# Altium schematic sheet DMX.SchDoc: DMX / RS485
size B; SheetNumber: 4; SheetTotal: 7; SPICEModelCacheBNOSHSNT: <root> / <DocumentId>BNOSHSNT</DocumentId> / <CacheFrame Number="0"> / <Model Name="di_2n7002k" Kind="MDL"> / <Text>*SRC=2N7002K;DI_2N7002K;MOSFETs N;Enh;60.0V 0.300A 2.00ohms  Diodes Inc. MOSFET / .MODEL DI_2N7002K  NMOS( LEVEL=1 VTO=2.50 KP=32.0m  GAMMA=3.10 / + PHI=.75  LAMBDA=104u RD=0.280 RS=0.280 / + IS=150f  PB=0.800 MJ=0.460 CBD=98.8p / + CBS=119p  CGSO=60.0n CGDO=50.0n CGBO=390n  )</Text> / </Model> / </CacheFrame> / </root>
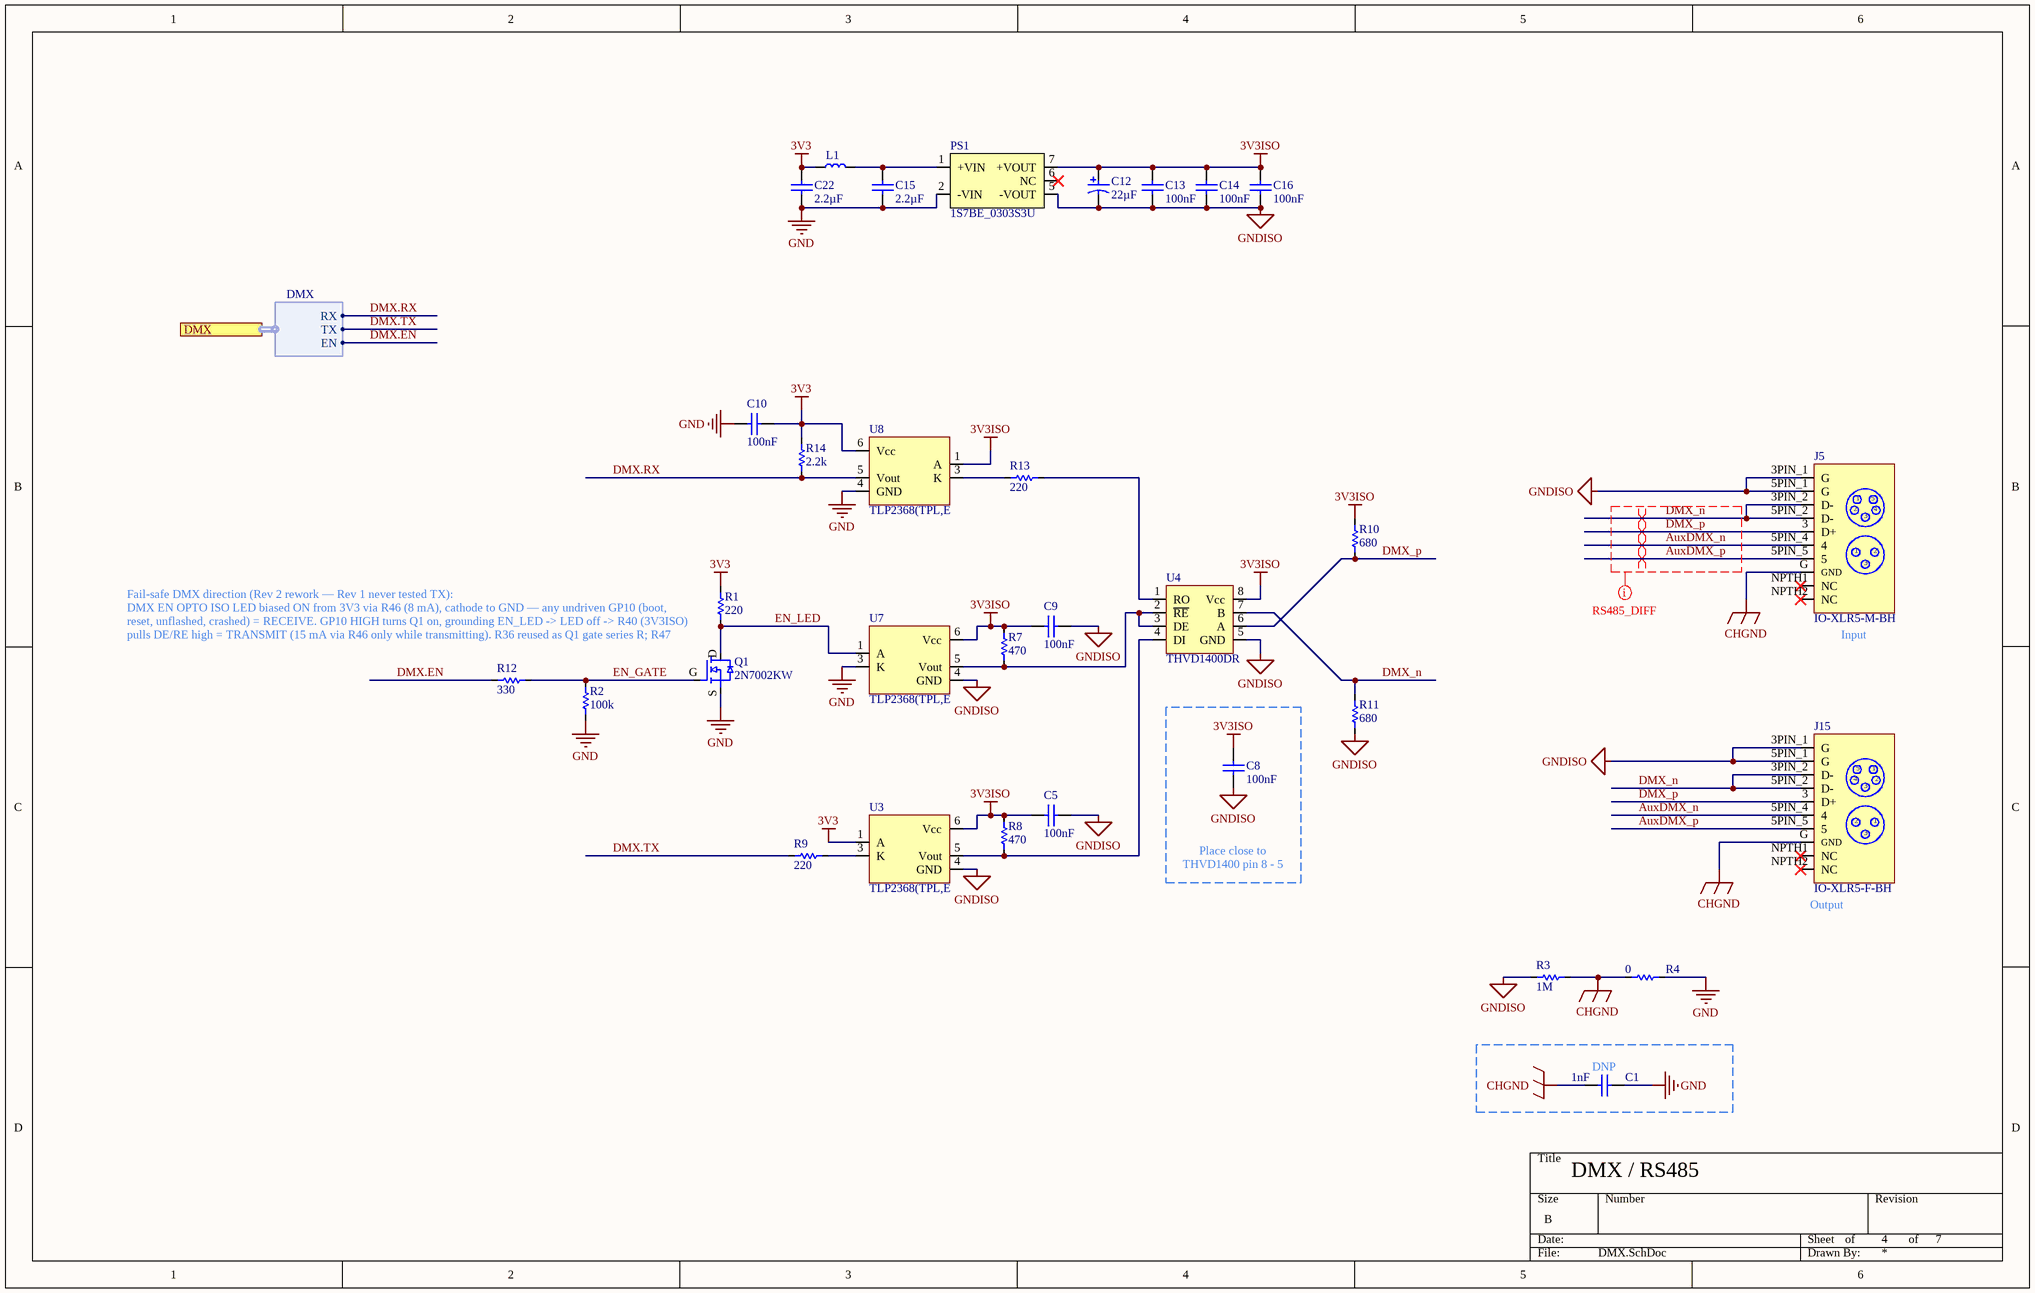
[diagram p0: DMX.SchDoc]

## Parts
C1  value 1nF  [CAPC1608X10N_0603_MED]  (hidden comment: C0603C102K5RACTU)
C5  value 100nF  [CAPC1608X10N_0603_MED]  (hidden comment: CC0603KRX7R0BB104)
C8  value 100nF  [CAPC1608X10N_0603_MED]  (hidden comment: CC0603KRX7R0BB104)
C9  value 100nF  [CAPC1608X10N_0603_MED]  (hidden comment: CC0603KRX7R0BB104)
C10  value 100nF  [CAPC1608X10N_0603_MED]  (hidden comment: CC0603KRX7R0BB104)
C12  value 22µF  [CAPCP3528X21N_1210_1411_MED]  (hidden comment: TPSB226K010R0500)
C13  value 100nF  [CAPC1608X10N_0603_MED]  (hidden comment: CC0603KRX7R0BB104)
C14  value 100nF  [CAPC1608X10N_0603_MED]  (hidden comment: CC0603KRX7R0BB104)
C15  value 2.2µF  [CAPC2012X14N_0805_MED]  (hidden comment: CGA4J3X7R1H225K125AE)
C16  value 100nF  [CAPC1608X10N_0603_MED]  (hidden comment: CC0603KRX7R0BB104)
C22  value 2.2µF  [CAPC2012X14N_0805_MED]  (hidden comment: CGA4J3X7R1H225K125AE)
J5  IO-XLR5-M-BH  [IO-XLR5-M-BH-Footprint-1]
J15  IO-XLR5-F-BH  [IO-XLR5-F-BH-Footprint-1]
L1  SRR6038-180Y  [IND_SRR6038-180Y]  (value not drawn)
PS1  1S7BE_0303S3U  [CONV_1S7BE_0303S3U]
Q1  2N7002KW  [ONSEMI_SOT65P210X110-3N]
R1  value 220  [RESC1608X06N_0603_MED]  (hidden comment: RC0603FR-07220RL)
R2  value 100k  [RESC1608X06N_0603_MED]  (hidden comment: RC0603DR-07100KL)
R3  value 1M  [RESC1608X06N_0603_MED]  (hidden comment: RC0603FR-071ML)
R4  value 0  [RESC1608X06N_0603_MED]  (hidden comment: RC0603FR-070RL)
R7  value 470  [RESC1608X06N_0603_MED]  (hidden comment: RC0603FR-07470RL)
R8  value 470  [RESC1608X06N_0603_MED]  (hidden comment: RC0603FR-07470RL)
R9  value 220  [RESC1608X06N_0603_MED]  (hidden comment: RC0603FR-07220RL)
R10  value 680  [RESC1608X06N_0603_MED]  (hidden comment: RC0603FR-07680RL)
R11  value 680  [RESC1608X06N_0603_MED]  (hidden comment: RC0603FR-07680RL)
R12  value 330  [RESC1608X06N_0603_MED]  (hidden comment: RC0603FR-07330RL)
R13  value 220  [RESC1608X06N_0603_MED]  (hidden comment: RC0603FR-07220RL)
R14  value 2.2k  [RESC1608X06N_0603_MED]  (hidden comment: RC0603FR-072K2L)
U3  TLP2368(TPL,E  [SOT125P700X220-5N]
U4  THVD1400DR  [SOIC127P600X175-8N]
U7  TLP2368(TPL,E  [SOT125P700X220-5N]
U8  TLP2368(TPL,E  [SOT125P700X220-5N]

## Ports
DMX (harness DMX)

## Harnesses
DMX: RX, EN, TX

## Nets
3V3: C10.1 C22.2 L1.1 R1.2 R14.2 U3.1(A) U8.6(Vcc)
3V3ISO: C5.2 C8.1 C9.2 C12.1 C13.2 C14.2 C16.2 PS1.7(+VOUT) R7.2 R8.2 R10.2 U3.6(Vcc) U4.8(Vcc) U7.6(Vcc) U8.1(A)
CHGND: C1.1 J5.G(GND) J15.G(GND) R3.2 R4.1
GND: C1.2 C10.2 C15.1 C22.1 PS1.2(-VIN) Q1.S R2.1 R4.2 U7.3(K) U8.4(GND)
GNDISO: C5.1 C8.2 C9.1 C12.2 C13.1 C14.1 C16.1 J5.3PIN_1(G) J5.5PIN_1(G) J15.3PIN_1(G) J15.5PIN_1(G) PS1.5(-VOUT) R3.1 R11.1 U3.4(GND) U4.5(GND) U7.4(GND)
AuxDMX_n: J5.5PIN_4(4) J15.5PIN_4(4)
AuxDMX_p: J5.5PIN_5(5) J15.5PIN_5(5)
DMX.EN: R12.1 ; port DMX.EN
DMX.RX: R14.1 U8.5(Vout) ; port DMX.RX
DMX.TX: R9.1 ; port DMX.TX
DMX_n: J5.3PIN_2(D-) J5.5PIN_2(D-) J15.3PIN_2(D-) J15.5PIN_2(D-) R11.2 U4.7(B)
DMX_p: J5.3(D+) J15.3(D+) R10.1 U4.6(A)
EN_GATE: Q1.G R2.2 R12.2
EN_LED: Q1.D R1.1 U7.1(A)
NetC15_2: C15.2 L1.2 PS1.1(+VIN)
NetR7_1: R7.1 U4.2(~{RE}) U4.3(DE) U7.5(Vout)
NetR8_1: R8.1 U3.5(Vout) U4.4(DI)
NetR9_2: R9.2 U3.3(K)
NetR13_1: R13.1 U8.3(K)
NetR13_2: R13.2 U4.1(RO)

Not connected (* = marked no-connect by the designer): J5 NPTH1(NC)* NPTH2(NC)*; J15 NPTH1(NC)* NPTH2(NC)*; PS1 6(NC)*

## Layout directives
differential pair; differential pair class 120DP: AuxDMX_n, AuxDMX_p, DMX_n, DMX_p
rule Impedance Constraint [Min = 110.0    Max = 130.0    ]; net class RS485; rule Matched Net Lengths [Tolerance = 10mil]: AuxDMX_n, AuxDMX_p, DMX_n, DMX_p

## Notes on the sheet
- Fail-safe DMX direction (Rev 2 rework — Rev 1 never tested TX):
  DMX EN OPTO ISO LED biased ON from 3V3 via R46 (8 mA), cathode to GND — any undriven GP10 (boot, reset, unflashed, crashed) = RECEIVE. GP10 HIGH turns Q1 on, grounding EN_LED -> LED off -> R40 (3V3ISO) pulls DE/RE high = TRANSMIT (15 mA via R46 only while transmitting). R36 reused as Q1 gate series R; R47 holds gate low.
  Firmware convention unchanged: GP10 HIGH = TX, LOW/Hi-Z = RX.
- (near J5) Input
- Place close to THVD1400 pin 8 - 5
- (near J15) Output
- (near C1) DNP
- of
- (in symbol CMP-002-00191-7) 1; 2
- (in symbol CMP-002-00192-4) 1; 2

## Library data of the parts
C1 = CMP-001-00160-2: Ceramic Capacitor, Multilayer, Ceramic, 50V, 10% +Tol, 10% -Tol, X7R, 15% TC, 0.001uF, Surface Mount, 0603; Max Operating Temperature: 125°C; Case/Package: 0603; Mounting Technology: Surface Mount; Voltage Rating: 50V; Pins: 2; Tolerance: 10%; JLCPN: C2167129; RoHS Compliant: Yes; Min Operating Temperature: -55°C; Capacitor Type: Ceramic
C5 C8-C10 C13 C14 C16 = CMP-001-00102-4: Ceramic Capacitor, Multilayer, Ceramic, 100V, 10% +Tol, 10% -Tol, X7R, 15% TC, 0.1uF, Surface Mount, 0603; Max Operating Temperature: 125°C; RoHS Compliant: Yes; Case/Package: 0603; Mounting Technology: Surface Mount; Capacitor Type: Ceramic; Pins: 2; Voltage Rating: 100V; Min Operating Temperature: -55°C; JLCPN: C113803
C12 = CMP-001-00100-5: Tantalum Capacitor, Polarized, Tantalum (dry/solid), 10V, 10% +Tol, 10% -Tol, 22uF, Surface Mount, 1210; Case/Package: 1411; Pins: 2; Capacitor Type: Tantalum; Voltage Rating: 10V; Max Operating Temperature: 125°C; Mounting Technology: Surface Mount; Tolerance: 10%; RoHS Compliant: Yes; Min Operating Temperature: -55°C; JLCPN: C55530
C15 C22 = CMP-001-00170-2: Ceramic Capacitor, Multilayer, Ceramic, 2.2uF, 50V, 10%, X6S, 0805; Max Operating Temperature: 125°C; Min Operating Temperature: -55°C; Voltage Rating: 50V; Tolerance: 10%; Capacitor Type: Ceramic; RoHS Compliant: Yes; Pins: 2; Mounting Technology: Surface Mount; Case/Package: 0805; JLCPN: C125847
J5 = CMP-002-00191-7: B Series, 5 Pin XLR, Male, Horizontal Pcb Mount With Separate Ground Pin; Gender: Male; Connector Type: XLR; Pins: 5
J15 = CMP-002-00192-4: B-Series 5-Pin XLR Female Horizontal PCB Mount with Separate Ground-Pin Metal Face Plate; Connector Type: XLR; Pins: 5; Gender: Female
L1 = CMP-006-00028-1: General Purpose Inductor, 18uH, 30%, 1 Element, Ferrite-Core, SMD, 2727; Max Current Rating: 1.7A; Self Resonant Frequency: 13.8MHz; Min Operating Temperature: -40°C; Max Operating Temperature: 125°C; Tolerance: 30%; Pins: 2; RoHS Compliant: Yes
PS1 = CMP-112-000000-3: ISOLATED MODULE DC DC CONVERTERS; MF: Gaptec; Design Item ID: 1S7BE_0303S3U; Source: 1S7BE_0303S3U.SchLib; SnapEDA_Link: https://www.snapeda.com/parts/1S7BE_0303S3U/Gaptec/view-part/?ref=snap; Package: SIP-7 Gaptec; MP: 1S7BE_0303S3U; Check_prices: https://www.snapeda.com/parts/1S7BE_0303S3U/Gaptec/view-part/?ref=eda; Value: *
Q1 = CMP-013-00041-2: Small Signal Field-Effect Transistor, 0.31A I(D), 60V, 1-Element, N-Channel, Silicon, Metal-oxide Semiconductor FET; Max Operating Temperature: 150°C; Pins: 3; RoHS Compliant: Yes; Case/Package: SC-70, SOT-323
R1 = CMP-009-00202-2: Fixed Resistor, Metal Glaze/thick Film, 0.1W, 220ohm, 75V, 1% +/-Tol, 100ppm/Cel, Surface Mount, 0603; Voltage Rating: 50V; Power: 100mW; Pins: 2; JLCPN: C22962; Tolerance: 1%; Max Operating Temperature: 155°C; Min Operating Temperature: -55°C; Case/Package: 0603; RoHS Compliant: Yes; Mounting Technology: Surface Mount
R2 = CMP-009-00328-3: Fixed Resistor, Metal Glaze/thick Film, 0.1W, 100000ohm, 75V, 0.5% +/-Tol, 100ppm/Cel, Surface Mount, 0603; Power: 100mW; Voltage Rating: 50V; Min Operating Temperature: -55°C; Mounting Technology: Surface Mount; RoHS Compliant: Yes; Pins: 2; JLCPN: C25803; Max Operating Temperature: 155°C; Case/Package: 0603; Tolerance: 0.5%
R3 = CMP-009-00342-2: Fixed Resistor, Metal Glaze/thick Film, 0.1W, 1Mohm,; Voltage Rating: 25V; Tolerance: 1%; Power: 100mW; JLCPN: C22935; Min Operating Temperature: -55°C; Max Operating Temperature: 155°C; RoHS Compliant: Yes; Case/Package: 0603; Pins: 2; Mounting Technology: Surface Mount
R4 = CMP-009-00204-6: RC Series 0603 0.1 W 0 Ohm Jumper Surface Mount Thick Film Chip Resistor; Power: 100mW; Voltage Rating: 75V; Tolerance: 1%; Max Operating Temperature: 155°C; JLCPN: C21189; Pins: 2; Case/Package: 0603; RoHS Compliant: Yes; Mounting Technology: Surface Mount; Min Operating Temperature: -55°C
R7 R8 = CMP-009-00300-2: Fixed Resistor, Metal Glaze/thick Film, 0.1W, 470ohm, 75V, 1% +/-Tol, 100ppm/Cel, Surface Mount, 0603; Power: 100mW; Voltage Rating: 50V; Case/Package: 0603; Tolerance: 1%; Mounting Technology: Surface Mount; Max Operating Temperature: 155°C; Pins: 2; RoHS Compliant: Yes; Min Operating Temperature: -55°C; JLCPN: C114669
R9 R13 = CMP-009-00202-2: Fixed Resistor, Metal Glaze/thick Film, 0.1W, 220ohm, 75V, 1% +/-Tol, 100ppm/Cel, Surface Mount, 0603; Power: 100mW; Voltage Rating: 50V; Min Operating Temperature: -55°C; Pins: 2; RoHS Compliant: Yes; Tolerance: 1%; Mounting Technology: Surface Mount; Max Operating Temperature: 155°C; Case/Package: 0603; JLCPN: C22962
R10 R11 = CMP-009-00301-2: Fixed Resistor, Metal Glaze/thick Film, 0.1W, 680ohm, 75V, 1% +/-Tol, 100ppm/Cel, Surface Mount, 0603; Voltage Rating: 50V; Power: 100mW; Mounting Technology: Surface Mount; Min Operating Temperature: -55°C; Tolerance: 1%; Pins: 2; Case/Package: 0603; Max Operating Temperature: 155°C; RoHS Compliant: Yes; JLCPN: C112310
R12 = CMP-009-00302-3: Fixed Resistor, Metal Glaze/thick Film, 0.1W, 330ohm, 75V, 1% +/-Tol, 100ppm/Cel, Surface Mount, 0603; Power: 100mW; Voltage Rating: 50V; Min Operating Temperature: -55°C; Pins: 2; RoHS Compliant: Yes; Tolerance: 1%; Mounting Technology: Surface Mount; Max Operating Temperature: 155°C; Case/Package: 0603; JLCPN: C23138
R14 = CMP-009-00304-2: Fixed Resistor, Metal Glaze/thick Film, 0.1W, 2200ohm, 75V, 1% +/-Tol, 100ppm/Cel, Surface Mount, 0603; Power: 100mW; Voltage Rating: 50V; Min Operating Temperature: -55°C; Max Operating Temperature: 155°C; Tolerance: 1%; Case/Package: 0603; Pins: 2; Mounting Technology: Surface Mount; RoHS Compliant: Yes; JLCPN: C114662
U3 U7 U8 = CMP-00026-00002-1: Logic IC Output Optocoupler, 1-Channel, 1-Element, 3750V Isolation, 20MBps; Max Operating Temperature: 125°C; Min Operating Temperature: -40°C; RoHS Compliant: Yes; Mounting Technology: Surface Mount
U4 = CMP-015-00028-2: Line Transceiver, 1 Func, 1 Driver, 1 Rcvr, PDSO8; RoHS Compliant: Yes; JLCPN: C3235232